# EAGLE schematic Weather Board (EAGLE 6.4)
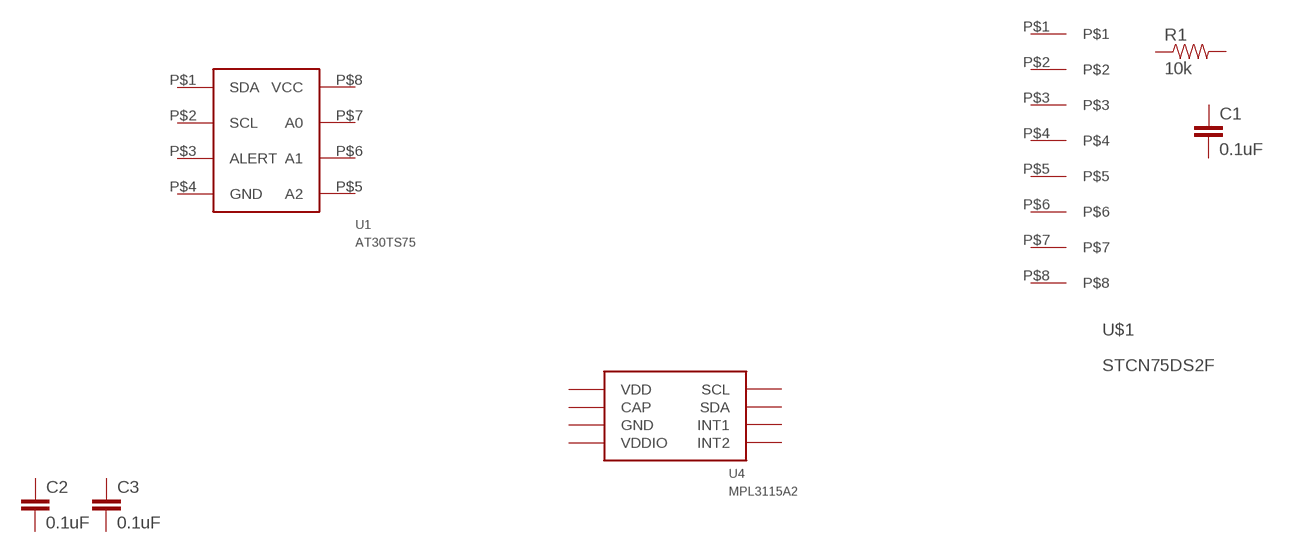
[diagram p0: schematic, sheet 1]

## Parts
C1  0.1uF  CAPACITOR0.01U-X7R-10%-25V-0603  [C0603]
C2  0.1uF  CAPACITOR0.1U-X7R-10%-10V  [C0603]
C3  0.1uF  CAPACITOR0.1U-X7R-10%-10V  [C0603]
R1  10k  RESISTOR10K-63M-1%-50V  [R0603]
U1  AT30TS75  [MSOP-8]
U4  MPL3115A2  [LGA-8(5X3)]
U$1  STCN75DS2F  [MSOP-8]
Unconnected: C1.1 C1.2 C2.1 C2.2 C3.1 C3.2 R1.1 R1.2 U1.P$1(SDA) U1.P$2(SCL) U1.P$3(ALERT) U1.P$4(GND) U1.P$5(A2) U1.P$6(A1) U1.P$7(A0) U1.P$8(VCC) U4.P$1(VDD) U4.P$2(CAP) U4.P$3(GND) U4.P$4(VDDIO) U4.P$5(INT2) U4.P$6(INT1) U4.P$7(SDA) U4.P$8(SCL) U$1.P$1 U$1.P$2 U$1.P$3 U$1.P$4 U$1.P$5 U$1.P$6 U$1.P$7 U$1.P$8

## Library data of the parts
C1 = Kas-Capacitors:CAPACITOR: Ceramic SMT Capacitor; DIELECTRIC: X7R; MANUFACTURER: Murata; MANUFACTURER_PART_NUMBER: GRM188R71E104KA01D; NEWARK-PAR_NUMBER: 14T3317; TEMPERATURE: -55 ~ 125; TOLARANCE: 10%; VOLTAGE: 25
C2 C3 = Kas-Capacitors:CAPACITOR: Ceramic SMT Capacitor; DIELECTRIC: X7R; MANUFACTURER: Multicomp; MANUFACTURER_PART_NUMBER: MCSH18B104K100CT; NEWARK_PART_NUMBER: 23T7300; TEMPERATURE: -55 ~ 125; TOLARANCE: 10%; VOLTAGE: 10
R1 = Kas-Resistors:RESISTOR: 0402 Resistor; MANUFACTURER: TE Connectivity; MANUFACTURER_PART_NUMBER: CPF0603F10KC1; NEWARK_PART_NUMBER: 51R8604; TEMPERATURE_COEFFICIENT: 50ppm; TOLARANCE: 1%; VOLTAGE: 50
U1 = Kas-Sensors:AT30TS75: AT30TS75 Temperature sensor 9- to 12-bit Selectable, ±0.5°C Accurate Digital Temperature Sensor
U4 = Kas-Sensors:MPL3115A2: MPL3115A2 Pressure sensor MPL3115A2: 50 to 110kPa, 2.5v, Absolute Xtrinsic Smart Pressure Sensor
U$1 = Kas-Sensors:STCN75DS2F